# EAGLE design micro_game (EAGLE 6.6.0)
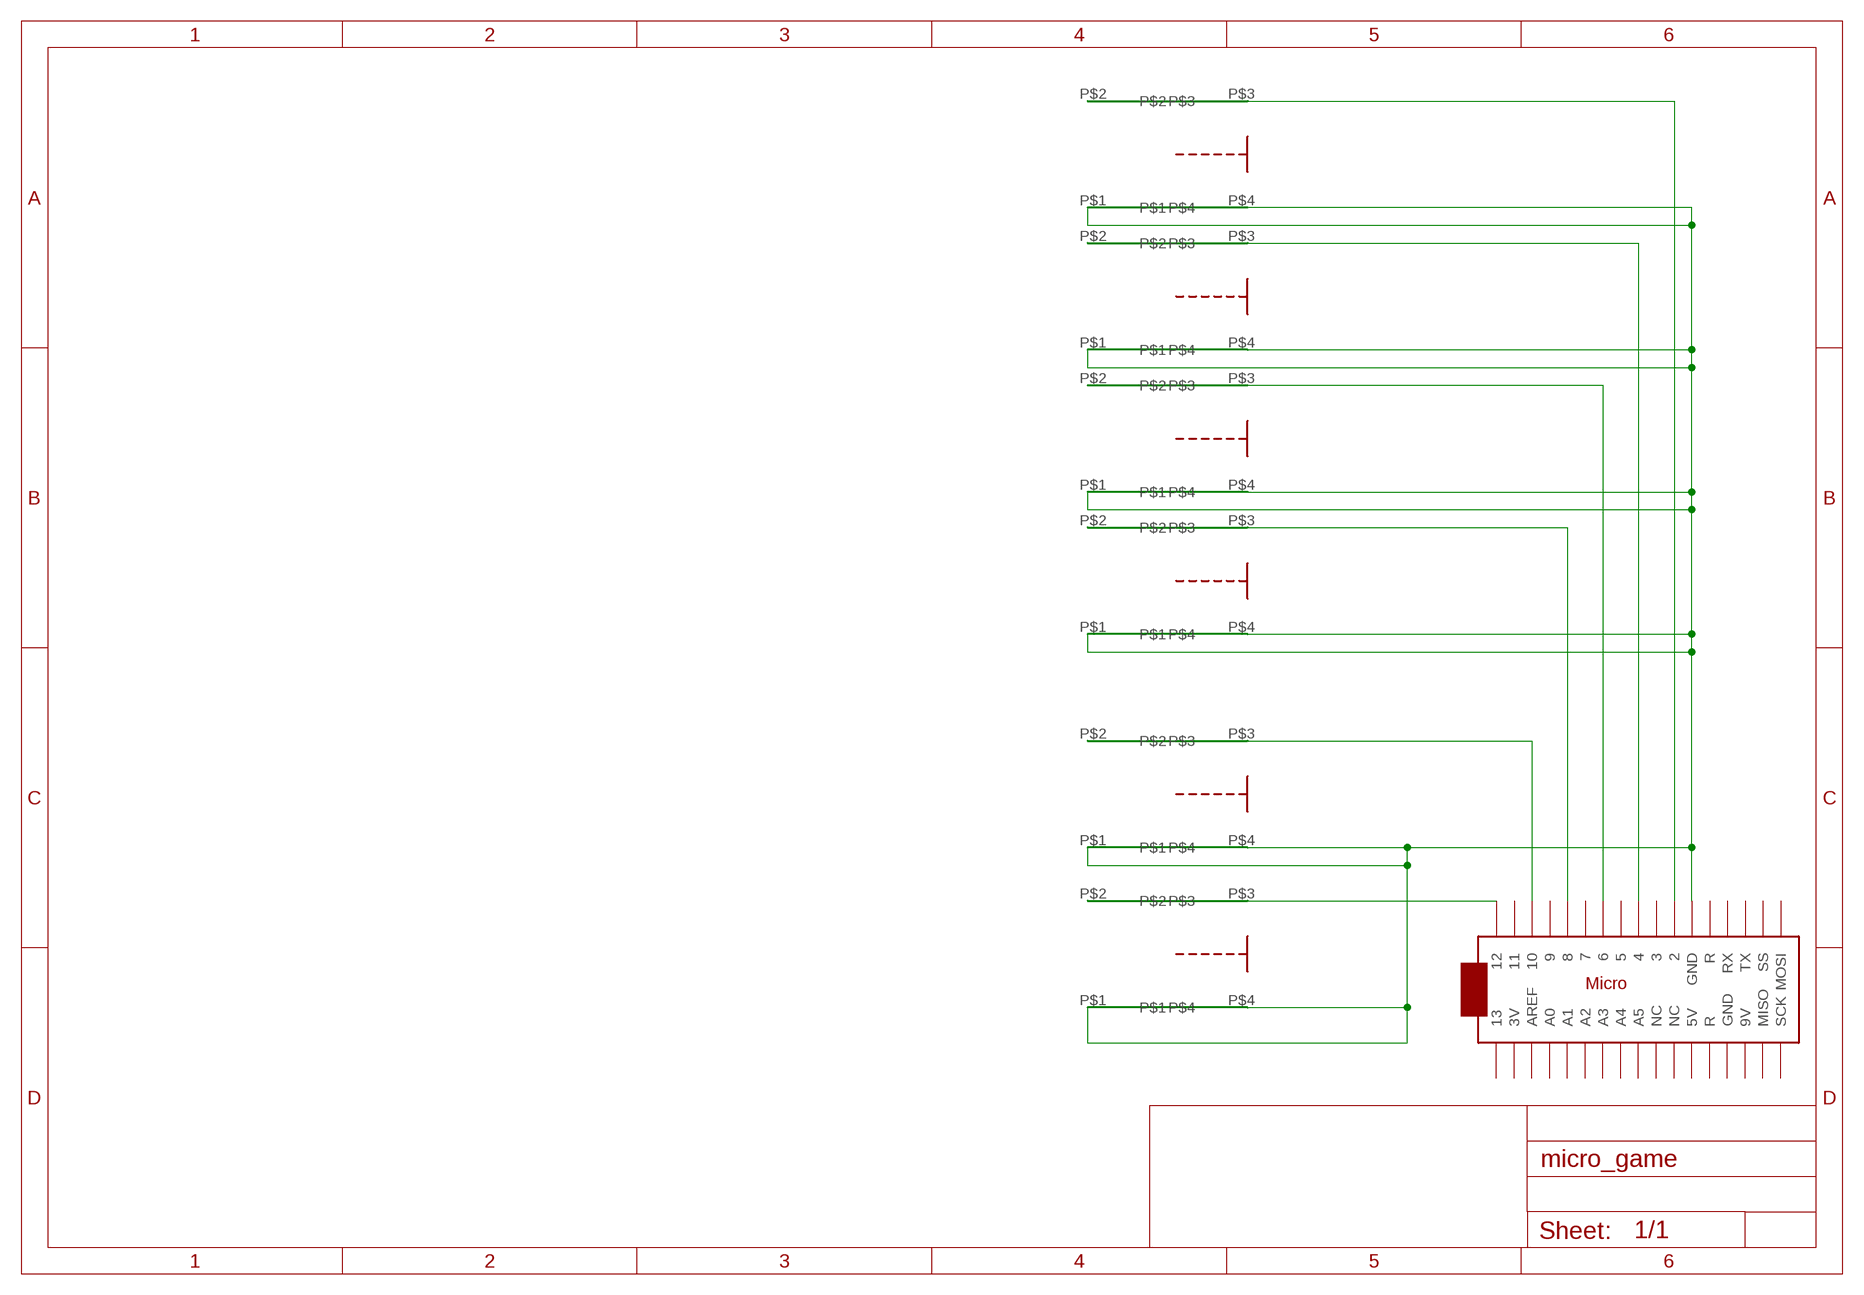
[diagram p0: schematic, sheet 1]

## Parts
U$1  ARDUINOMICRO  [ARDUINOMICRO]
U$2  MICRO_GAME_SWITCH  [MICRO_GAME_SWITCH]
U$3  MICRO_GAME_SWITCH  [MICRO_GAME_SWITCH]
U$4  MICRO_GAME_SWITCH  [MICRO_GAME_SWITCH]
U$5  MICRO_GAME_SWITCH  [MICRO_GAME_SWITCH]
U$6  MICRO_GAME_SWITCH  [MICRO_GAME_SWITCH]
U$7  MICRO_GAME_SWITCH  [MICRO_GAME_SWITCH]

## Nets
GND: U$1.P$21(GND) U$2.P$1 U$2.P$4 U$3.P$1 U$3.P$4 U$4.P$1 U$4.P$4 U$5.P$1 U$5.P$4 U$6.P$1 U$6.P$4 U$7.P$1 U$7.P$4
N$1: U$1.P$11 U$4.P$3
N$2: U$1.P$9 U$2.P$3
N$3: U$1.P$7 U$3.P$3
N$4: U$1.P$5 U$5.P$3
N$5: U$1.P$3 U$6.P$3
N$6: U$1.P$1 U$7.P$3
Unconnected: U$1.P$2 U$1.P$4 U$1.P$6 U$1.P$8 U$1.P$10 U$1.P$12(GND) U$1.P$13(R) U$1.P$14(RX) U$1.P$15(TX) U$1.P$16(SS) U$1.P$17(MOSI) U$1.P$18(SCK) U$1.P$19(MISO) U$1.P$20(9V) U$1.P$22(R) U$1.P$23(5V) U$1.P$24(NC) U$1.P$25(NC) U$1.P$26(A5) U$1.P$27(A4) U$1.P$28(A3) U$1.P$29(A2) U$1.P$30(A1) U$1.P$31(A0) U$1.P$32(AREF) U$1.P$33(3V) U$1.P$34 U$2.P$2 U$3.P$2 U$4.P$2 U$5.P$2 U$6.P$2 U$7.P$2

## Library data of the parts
U$1 = adafruit:ARDUINOMICRO
U$2-U$7 = micro_game_switch:MICRO_GAME_SWITCH

## Board
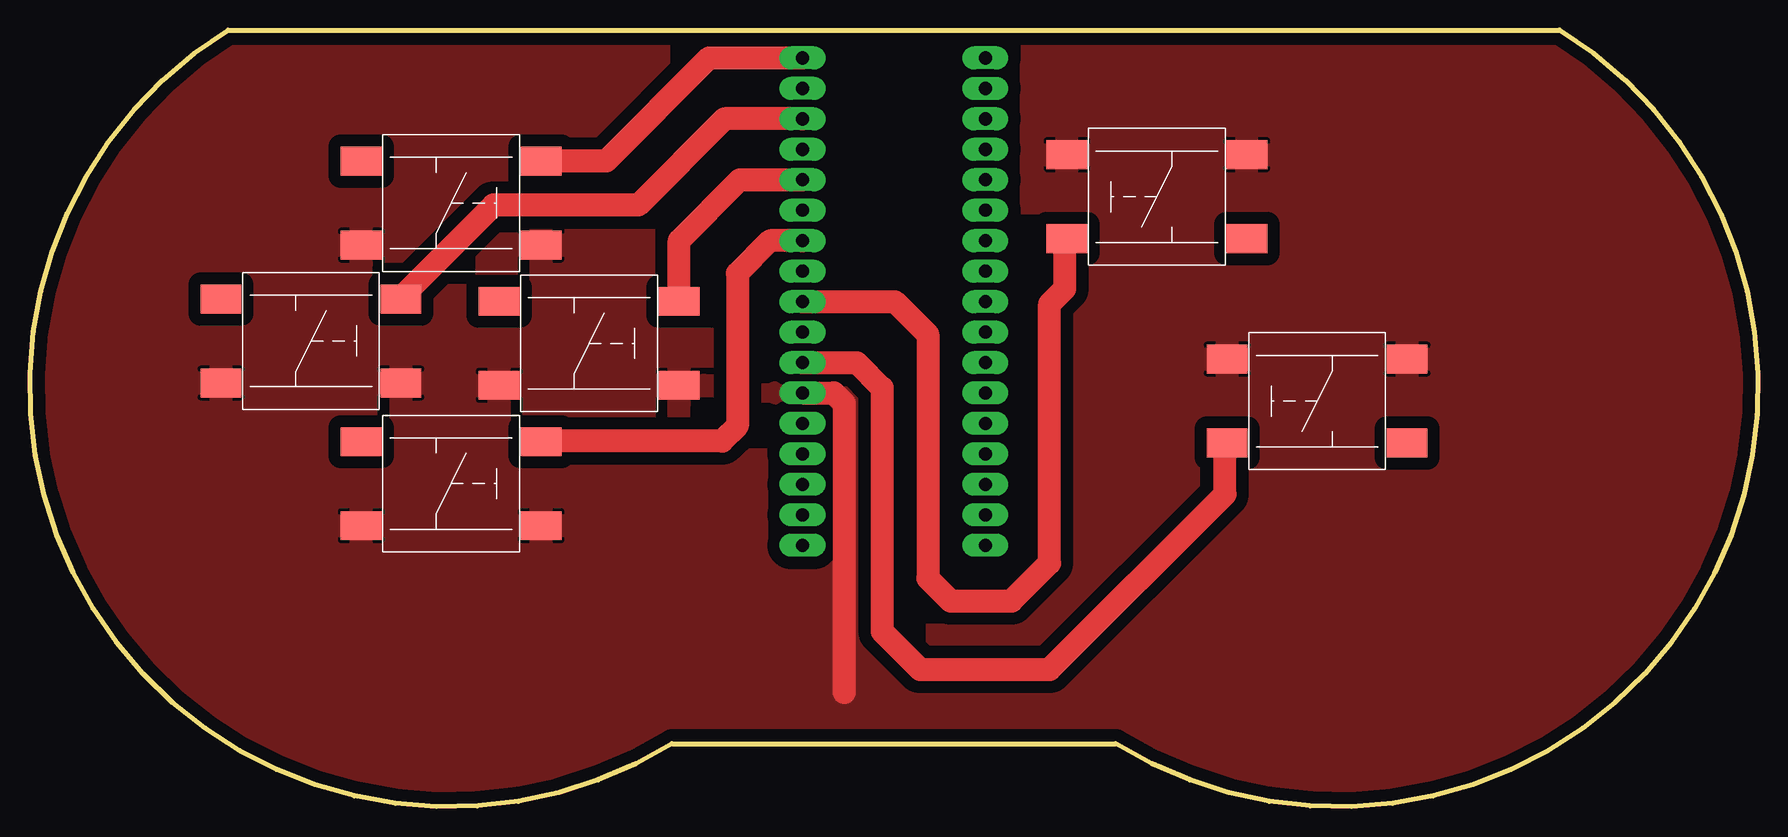
[diagram p1: board, top side]
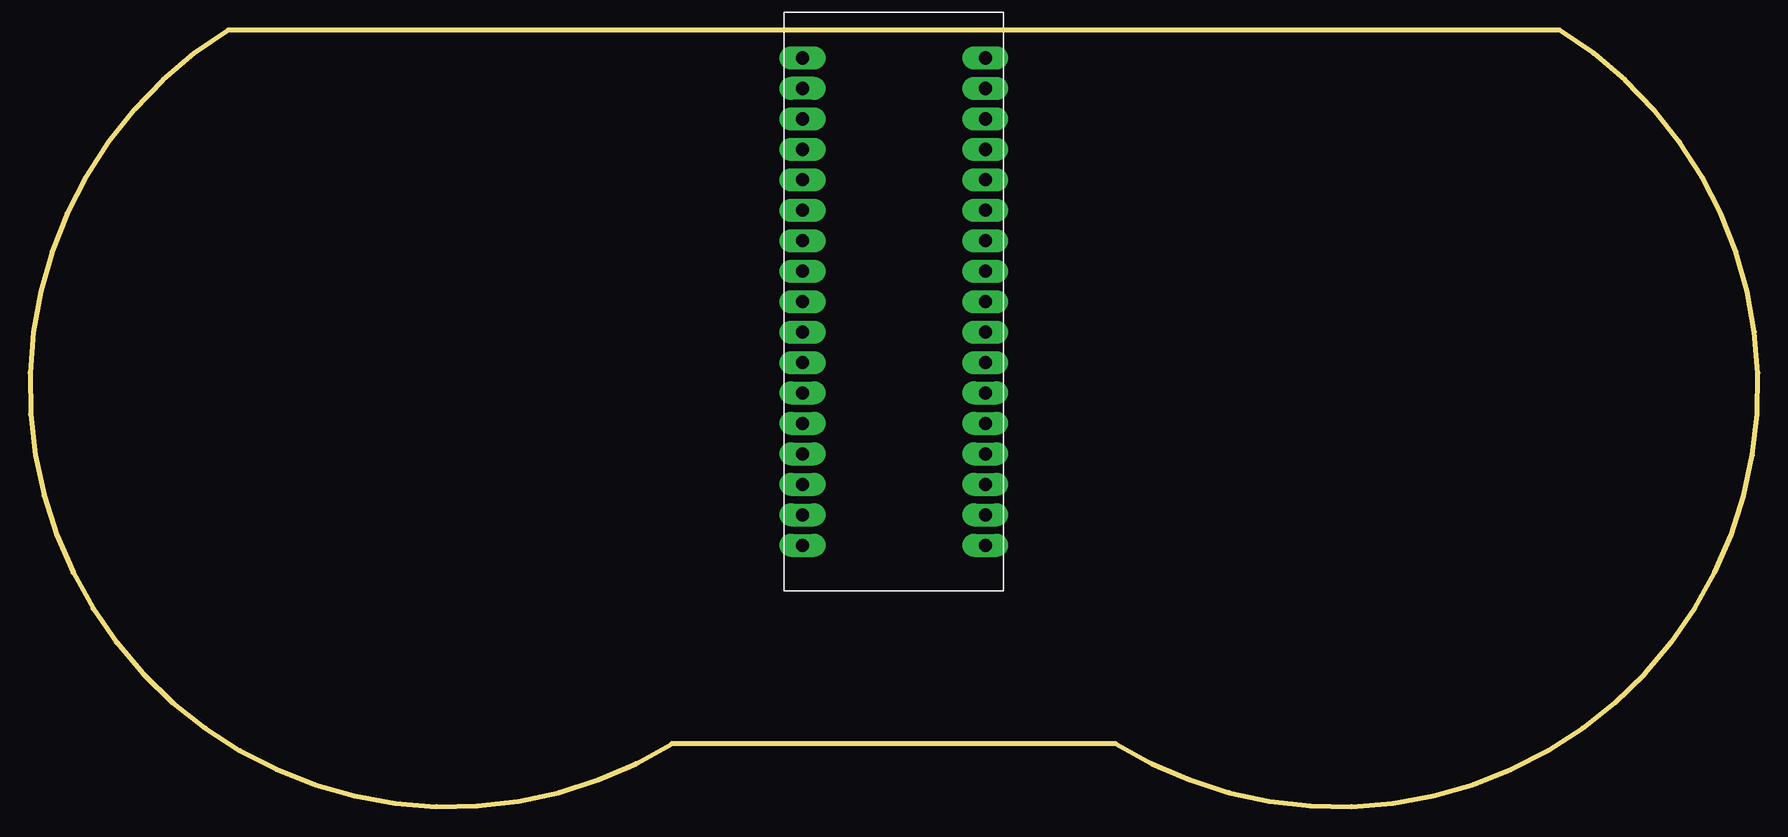
[diagram p2: board, bottom side, seen from below]

Size 144.03 x 64.76 mm. Coordinates in mm from the lower left corner, seen from the top.
Outline: 114.51,64.76 127.51,64.76
Outline: 127.51,64.76 16.51,64.76 arc180 53.51,5.26 90.51,5.26 arc180 127.51,64.76
Copper layers (1*16): Top 0.035mm / dielectric 1.5mm / Bottom 0.035mm
Design rules "default": minimum track width 10mil, minimum drill 24mil, track to track 8mil, track to pad 8mil, pad to pad 8mil, via to via 8mil, smd to smd 8mil, copper to edge 40mil, drill to drill 8mil, minimum pad ring 10mil, minimum via ring 8mil, stop-mask expansion 4mil, vias tented up to drill 0mil, thermal gap 10mil

### Footprints (pad centres in the part's own frame; a part is rotated, then mirrored left to right if it is on the bottom)
ARDUINOMICRO = drill 1.1 pad 1.93 long: P$1 -20.32,7.62; P$2 -17.78,7.62; P$3 -15.24,7.62; P$4 -12.7,7.62; P$5 -10.16,7.62; P$6 -7.62,7.62; P$7 -5.08,7.62; P$8 -2.54,7.62; P$9 0,7.62; P$10 2.54,7.62; P$11 5.08,7.62; P$12 12.7,-7.62; P$13 10.16,-7.62; P$14 12.7,7.62; P$15 15.24,7.62; P$16 17.78,7.62; P$17 20.32,7.62; P$18 20.32,-7.62; P$19 17.78,-7.62; P$20 15.24,-7.62; P$21 7.62,7.62; P$22 10.16,7.62; P$23 7.62,-7.62; P$24 5.08,-7.62; P$25 2.54,-7.62; P$26 0,-7.62; P$27 -2.54,-7.62; P$28 -5.08,-7.62; P$29 -7.62,-7.62; P$30 -10.16,-7.62; P$31 -12.7,-7.62; P$32 -15.24,-7.62; P$33 -17.78,-7.62; P$34 -20.32,-7.62
MICRO_GAME_SWITCH = smd 3.4 x 2.4: P$1 -7.5,-3.5; P$2 -7.5,3.5; P$3 7.5,3.5; P$4 7.5,-3.5

### Placement (x,y rotation side)
U$1  72.01,42.11 270 bottom
U$2  93.93,50.86 180 top
U$3  35.1,26.93 0 top
U$4  107.29,33.82 180 top
U$5  46.6,38.63 0 top
U$6  23.42,38.83 0 top
U$7  35.1,50.33 0 top

### Tracks (layer width: path | path; a pad name or v marks a point on that pad's centre or on a via)
GND
  Top 1.93: U$1.P$21 67.02,34.49 67.85,33.66 67.85,9.53
  pour Top (isolate 1.016): -17.87,-15.87 153.58,-15.87 153.58,83.82 -17.87,83.82
N$1
  Top 1.93: U$1.P$11 68.92,37.03 71.03,34.93 71.03,14.61 74.2,11.43 85,11.43 99.6,26.04 99.6,30.13 U$4.P$3
N$2
  Top 1.93: U$1.P$9 72.1,42.11 74.84,39.37 74.84,19.05 76.74,17.15 81.82,17.15 85,20.32 85,41.91 86.27,43.18 86.27,47.2 U$2.P$3
N$3
  Top 1.93: U$1.P$7 61.7,47.19 58.96,44.45 58.96,31.75 57.69,30.48 42.65,30.48 U$3.P$3
N$4
  Top 1.93: U$5.P$3 54.1,47.21 59.16,52.27 U$1.P$5
N$5
  Top 1.93: U$6.P$3 30.92,42.45 38.64,50.17 50.71,50.17 57.89,57.35 U$1.P$3
N$6
  Top 1.93: U$7.P$3 48.02,53.83 56.62,62.43 U$1.P$1